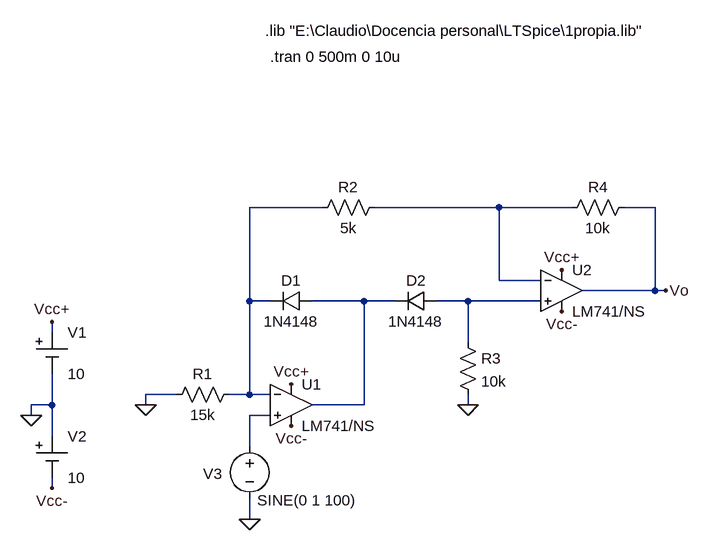
[diagram p0: schematic rectificador duplicador.asc]
rectificador duplicador.asc, the LTspice schematic file:
Version 4
SHEET 1 1508 1252
WIRE 304 -112 192 -112
WIRE 576 -112 384 -112
WIRE 688 -112 576 -112
WIRE 816 -112 768 -112
WIRE 576 0 576 -112
WIRE 640 0 576 0
WIRE 816 16 816 -112
WIRE 816 16 704 16
WIRE 832 16 816 16
WIRE 192 32 192 -112
WIRE 224 32 192 32
WIRE 368 32 288 32
WIRE 416 32 368 32
WIRE 528 32 480 32
WIRE 640 32 528 32
WIRE -112 80 -112 64
WIRE 528 96 528 32
WIRE 80 176 32 176
WIRE 192 176 192 32
WIRE 192 176 160 176
WIRE 224 176 192 176
WIRE -112 192 -112 144
WIRE -112 192 -144 192
WIRE 32 192 32 176
WIRE 368 192 368 32
WIRE 368 192 288 192
WIRE 528 192 528 176
WIRE -144 208 -144 192
WIRE 224 208 192 208
WIRE -112 240 -112 192
WIRE 192 256 192 208
WIRE -112 320 -112 304
WIRE 192 368 192 336
FLAG -144 208 0
FLAG -112 64 Vcc+
FLAG -112 320 Vcc-
FLAG 256 224 Vcc-
FLAG 256 160 Vcc+
FLAG 672 -16 Vcc+
FLAG 672 48 Vcc-
FLAG 32 192 0
FLAG 528 192 0
FLAG 192 368 0
FLAG 832 16 Vo
SYMBOL res 176 160 R90
WINDOW 0 0 56 VBottom 2
WINDOW 3 32 56 VTop 2
SYMATTR InstName R1
SYMATTR Value 15k
SYMBOL res 400 -128 R90
WINDOW 0 0 56 VBottom 2
WINDOW 3 32 56 VTop 2
SYMATTR InstName R2
SYMATTR Value 5k
SYMBOL diode 288 16 R90
WINDOW 0 0 32 VBottom 2
WINDOW 3 32 32 VTop 2
SYMATTR InstName D1
SYMATTR Value 1N4148
SYMBOL diode 480 16 R90
WINDOW 0 0 32 VBottom 2
WINDOW 3 32 32 VTop 2
SYMATTR InstName D2
SYMATTR Value 1N4148
SYMBOL res 784 -128 R90
WINDOW 0 0 56 VBottom 2
WINDOW 3 32 56 VTop 2
SYMATTR InstName R4
SYMATTR Value 10k
SYMBOL res 512 80 R0
SYMATTR InstName R3
SYMATTR Value 10k
SYMBOL OpAmps\\opamp2 256 128 R0
SYMATTR InstName U1
SYMATTR Value LM741/NS
SYMBOL OpAmps\\opamp2 672 -48 R0
SYMATTR InstName U2
SYMATTR Value LM741/NS
SYMBOL voltage 192 240 R0
WINDOW 123 0 0 Left 0
WINDOW 39 0 0 Left 0
WINDOW 0 -71 58 Left 2
WINDOW 3 12 99 Left 2
SYMATTR InstName V3
SYMATTR Value SINE(0 1 100)
SYMBOL Misc\\cell -112 80 R0
WINDOW 123 0 0 Left 0
WINDOW 39 0 0 Left 0
SYMATTR InstName V1
SYMATTR Value 10
SYMBOL Misc\\cell -112 240 R0
WINDOW 123 0 0 Left 0
WINDOW 39 0 0 Left 0
SYMATTR InstName V2
SYMATTR Value 10
TEXT 224 -344 Left 2 !.tran 0 500m 0 10u
TEXT 216 -384 Left 2 !.lib "E:\\Claudio\\Docencia personal\\LTSpice\\1propia.lib"

The netlist it stands for:
* rectificador duplicador.asc
R1 N001 0 15k
R2 N002 N001 5k
D1 N003 N001 1N4148
D2 N004 N003 1N4148
R4 Vo N002 10k
R3 N004 0 10k
XU1 N005 N001 Vcc+ Vcc- N003 LM741/NS  ; pins In+ In- V+ V- OUT
XU2 N004 N002 Vcc+ Vcc- Vo LM741/NS  ; pins In+ In- V+ V- OUT
V3 N005 0 SINE(0 1 100)
V1 Vcc+ 0 10
V2 0 Vcc- 10
.model D D
.lib standard.dio
.tran 0 500m 0 10u
.lib "E:\Claudio\Docencia personal\LTSpice\1propia.lib"
.backanno
.end